# Altium project PCB.PrjPcb
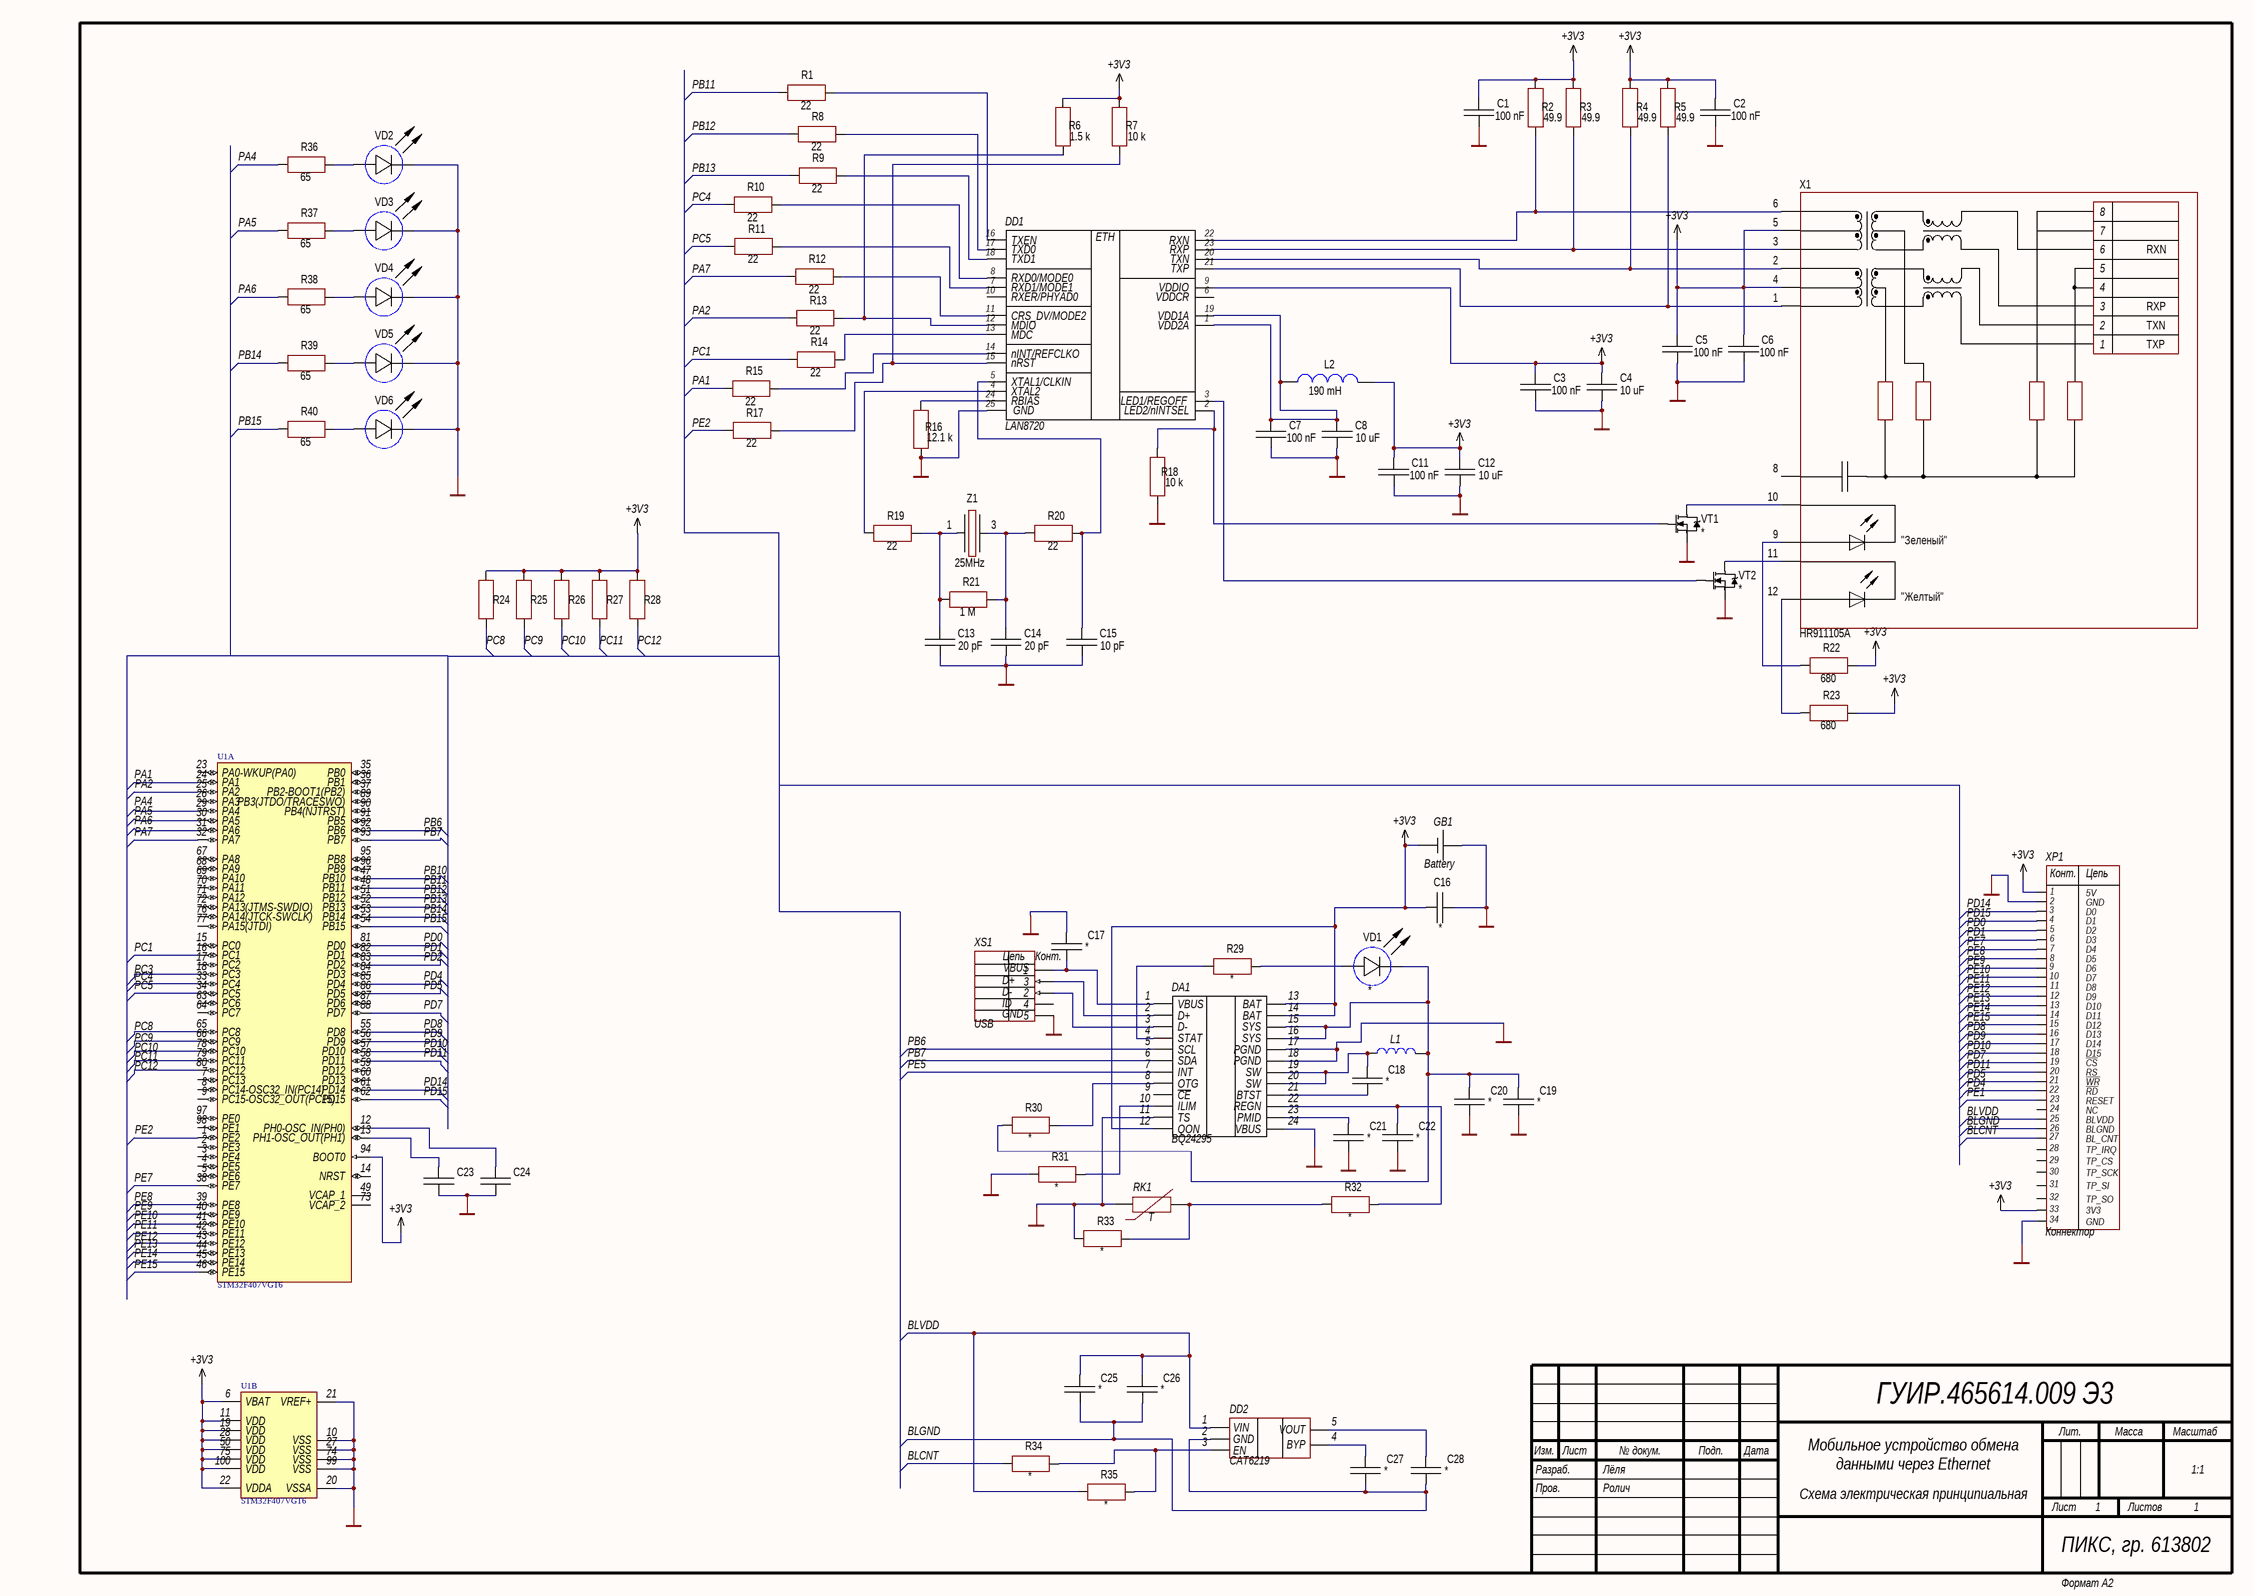
[diagram p0: Shcematic.SchDoc]
1 sheet, 86 parts. Net scope: global (net labels, ports and power ports of the same name join across sheets).
Board files: Ïå÷àòíàÿÏëàòàÑÝêðàíîì.PcbDoc, Ïå÷àòíàÿÏëàòà.PcbDoc

## Sheet Shcematic.SchDoc: Мобильное устройство обмена
size 594 x 420 mm; CheckedBy: Ролич; Author: Лёля; CompanyName: ПИКС, гр. 613802; Address1: Address1; Address2: Address2; Address3: Address3; Address4: Address4; DocumentNumber: ГУИР.465614.009 Э3; SheetNumber: 1; SheetTotal: 1; Scale: 1:1; Title2str: данными через Ethernet; DocumentType: Схема электрическая принципиальная; FirstReferrence: АБВГ.123456.001

### Parts
C1  100 nF  [CH0805C]
C2  100 nF  [CH0805C]
C3  100 nF  [CH0805C]
C4  10 uF  [CH0805C]
C5  100 nF  [CH0805C]
C6  100 nF  [CH0805C]
C7  100 nF  [CH0805C]
C8  10 uF  [CH0805C]
C11  100 nF  [CH0805C]
C12  10 uF  [CH0805C]
C13  20 pF  [CH0805C]
C14  20 pF  [CH0805C]
C15  10 pF  [CH0805C]
C16  *  [CH0805C]
C17  *  [CH0805C]
C18  *  [CH0805C]
C19  *  [CH0805C]
C20  *  [CH0805C]
C21  *  [CH0805C]
C22  *  [CH0805C]
C23  (no value)  [CH0805C]
C24  (no value)  [CH0805C]
C25  *  [CH0805C]
C26  *  [CH0805C]
C27  *  [CH0805C]
C28  *  [CH0805C]
DA1  BQ24295  [BQ24295]
DD1  LAN8720  [*QFN50P400X400X100-25N - duplicate]
DD2  CAT6219  [CAT6219]
GB1  Battery  [Battery]
L1  Inductor  [CH0805L]  (value not drawn)
L2  190 mH  [CH0805L]
R1  22  [CH0805R]
R2  49.9  [CH0805R]
R3  49.9  [CH0805R]
R4  49.9  [CH0805R]
R5  49.9  [CH0805R]
R6  1.5 k  [CH0805R]
R7  10 k  [CH0805R]
R8  22  [CH0805R]
R9  22  [CH0805R]
R10  22  [CH0805R]
R11  22  [CH0805R]
R12  22  [CH0805R]
R13  22  [CH0805R]
R14  22  [CH0805R]
R15  22  [CH0805R]
R16  12.1 k  [CH0805R]
R17  22  [CH0805R]
R18  10 k  [CH0805R]
R19  22  [CH0805R]
R20  22  [CH0805R]
R21  1 M  [CH0805R]
R22  680  [CH0805R]
R23  680  [CH0805R]
R24  (no value)  [CH0805R]
R25  (no value)  [CH0805R]
R26  (no value)  [CH0805R]
R27  (no value)  [CH0805R]
R28  (no value)  [CH0805R]
R29  *  [CH0805R]
R30  *  [CH0805R]
R31  *  [CH0805R]
R32  *  [CH0805R]
R33  *  [CH0805R]
R34  *  [CH0805R]
R35  *  [CH0805R]
R36  65  [CH0805R]
R37  65  [CH0805R]
R38  65  [CH0805R]
R39  65  [CH0805R]
R40  65  [CH0805R]
RK1  Resistor_termo  [0805 (Resistor)]  (value not drawn)
U1  STM32F407VGT6  [STM-LQFP100_L]  (parts A,B of 2)
VD1  *  [CH0603LB]
VD2  *  [CH0603LB]  (value not drawn)
VD3  *  [CH0603LB]  (value not drawn)
VD4  *  [CH0603LB]  (value not drawn)
VD5  *  [CH0603LB]  (value not drawn)
VD6  *  [CH0603LB]  (value not drawn)
VT1  *  [SOT23_123]
VT2  *  [SOT23_123]
X1  HR911105A  [CON: HR911105A]
XP1  Коннектор  [Connector]
XS1  USB  [USB]
Z1  25MHz  [OSC: 3215]

### Nets
+3V3: C1.1 C2.1 C3.1 C4.1 C5.1 C6.1 C11.1 C12.1 C16.1 DA1.12(QON) DA1.13(BAT) DA1.14(BAT) DD1.9(VDDIO) GB1.1 L2.1 R2.2 R3.2 R4.2 R5.2 R6.2 R7.2 R22.2 R23.2 R24.2 R25.2 R26.2 R27.2 R28.2 U1.6(VBAT) U1.11(VDD) U1.19(VDD) U1.22(VDDA) U1.28(VDD) U1.50(VDD) U1.75(VDD) U1.94(BOOT0) U1.100(VDD) X1.4(CT) X1.5(CT) XP1.1(5V) XP1.33(3V3)
GND: C1.2 C2.2 C3.2 C4.2 C5.2 C6.2 C7.2 C8.2 C11.2 C12.2 C13.2 C14.2 C15.2 C16.2 C17.1 C19.2 C20.2 C21.2 C22.2 C23.2 C24.2 DA1.11(TS) DA1.17(PGND) DA1.18(PGND) DA1.24(VBUS) DD1.25(GND) GB1.2 R16.1 R18.1 R31.1 R33.1 RK1.1 U1.10(VSS) U1.20(VSSA) U1.21(VREF+) U1.27(VSS) U1.74(VSS) U1.99(VSS) VD2.2(C) VD3.2(C) VD4.2(C) VD5.2(C) VD6.2(C) VT1.3(S) VT2.3(S) XP1.2(GND) XP1.34(GND) XS1.5
BLCNT: R34.1 XP1.27(BL_CNT)
BLGND: C25.2 C26.2 C27.2 C28.2 DD2.2(GND) XP1.26(BLGND)
BLVDD: C25.1 C26.1 DD2.1(VIN) R35.1 XP1.25(BLVDD)
PA1: R15.1 U1.24(PA1)
PA2: R13.1 U1.25(PA2)
PA4: R36.1 U1.29(PA4)
PA5: R37.1 U1.30(PA5)
PA6: R38.1 U1.31(PA6)
PA7: R12.1 U1.32(PA7)
PB6: DA1.5(SCL) U1.92(PB6)
PB7: DA1.6(SDA) U1.93(PB7)
PB10: U1.47(PB10)
PB11: R1.1 U1.48(PB11)
PB12: R8.1 U1.51(PB12)
PB13: R9.1 U1.52(PB13)
PB14: R39.1 U1.53(PB14)
PB15: R40.1 U1.54(PB15)
PC1: R14.1 U1.16(PC1)
PC3: U1.18(PC3)
PC4: R10.1 U1.33(PC4)
PC5: R11.1 U1.34(PC5)
PC8: R24.1 U1.65(PC8)
PC9: R25.1 U1.66(PC9)
PC10: R26.1 U1.78(PC10)
PC11: R27.1 U1.79(PC11)
PC12: R28.1 U1.80(PC12)
PD0: U1.81(PD0) XP1.5(D2)
PD1: U1.82(PD1) XP1.6(D3)
PD2: U1.83(PD2)
PD4: U1.85(PD4) XP1.22(~{RD})
PD5: U1.86(PD5) XP1.21(~{WR})
PD7: U1.88(PD7) XP1.19(~{CS})
PD8: U1.55(PD8) XP1.16(D13)
PD9: U1.56(PD9) XP1.17(D14)
PD10: U1.57(PD10) XP1.18(D15)
PD11: U1.58(PD11) XP1.20(RS)
PD14: U1.61(PD14) XP1.3(D0)
PD15: U1.62(PD15) XP1.4(D1)
PE1: XP1.23(RESET)
PE2: R17.1 U1.1(PE2)
PE5: DA1.7(INT)
PE7: U1.38(PE7) XP1.7(D4)
PE8: U1.39(PE8) XP1.8(D5)
PE9: U1.40(PE9) XP1.9(D6)
PE10: U1.41(PE10) XP1.10(D7)
PE11: U1.42(PE11) XP1.11(D8)
PE12: U1.43(PE12) XP1.12(D9)
PE13: U1.44(PE13) XP1.13(D10)
PE14: U1.45(PE14) XP1.14(D11)
PE15: U1.46(PE15) XP1.15(D12)
NetC7_1: C7.1 C8.1 DD1.1(VDD2A) DD1.19(VDD1A) L2.2
NetC13_1: C13.1 R19.2 R21.1 Z1.1
NetC14_1: C14.1 R20.1 R21.2 Z1.3
NetC15_1: C15.1 DD1.5(XTAL1/CLKIN) R20.2
NetC17_2: C17.2 DA1.1(VBUS) XS1.1
NetC18_1: C18.1 DA1.19(SW) DA1.20(SW) L1.1
NetC18_2: C18.2 DA1.21(BTST)
NetC19_1: C19.1 C20.1 DA1.15(SYS) DA1.16(SYS) L1.2 R30.1 VD1.2(C)
NetC21_1: C21.1 DA1.23(PMID)
NetC22_1: C22.1 DA1.22(REGN) R32.2
NetC23_1: C23.1 U1.13(PH1-OSC_OUT(PH1))
NetC24_1: C24.1 U1.12(PH0-OSC_IN(PH0))
NetC27_1: C27.1 DD2.4(BYP)
NetC28_1: C28.1 DD2.5(VOUT)
NetDA1_2: DA1.2(D+) XS1.3
NetDA1_3: DA1.3(D-) XS1.2
NetDA1_4: DA1.4(STAT) R29.1
NetDA1_8: DA1.8(OTG) R30.2
NetDA1_10: DA1.10(ILIM) R31.2
NetDD1_2: DD1.2(LED2/nINTSEL) R18.2 VT1.1(G)
NetDD1_3: DD1.3(LED1/REGOFF) VT2.1(G)
NetDD1_4: DD1.4(XTAL2) R19.1
NetDD1_7: DD1.7(RXD1/MODE1) R11.2
NetDD1_8: DD1.8(RXD0/MODE0) R10.2
NetDD1_11: DD1.11(CRS_DV/MODE2) R12.2
NetDD1_12: DD1.12(MDIO) R6.1 R13.2
NetDD1_13: DD1.13(MDC) R14.2
NetDD1_14: DD1.14(nINT/REFCLKO) R15.2
NetDD1_15: DD1.15(nRST) R7.1 R17.2
NetDD1_16: DD1.16(TXEN) R1.2
NetDD1_17: DD1.17(TXD0) R8.2
NetDD1_18: DD1.18(TXD1) R9.2
NetDD1_20: DD1.20(TXN) R4.1 X1.2(TD-)
NetDD1_21: DD1.21(TXP) R5.1 X1.1(TD+)
NetDD1_22: DD1.22(RXN) R2.1 X1.6(RD-)
NetDD1_23: DD1.23(RXP) R3.1 X1.3(RD+)
NetDD1_24: DD1.24(RBIAS) R16.2
NetDD2_3: DD2.3(EN) R34.2 R35.2
NetR22_1: R22.1 X1.9(D2)
NetR23_1: R23.1 X1.12(D4)
NetR29_2: R29.2 VD1.1(A)
NetR32_1: R32.1 R33.2 RK1.2
NetR36_2: R36.2 VD2.1(A)
NetR37_2: R37.2 VD3.1(A)
NetR38_2: R38.2 VD4.1(A)
NetR39_2: R39.2 VD5.1(A)
NetR40_2: R40.2 VD6.1(A)
NetVT1_2: VT1.2(D) X1.10(D1)
NetVT2_2: VT2.2(D) X1.11(D3)

Not connected (* = marked no-connect by the designer): DA1 9(~{CE}); DD1 6(VDDCR) 10(RXER/PHYAD0); U1 2(PE3) 3(PE4) 4(PE5) 5(PE6) 7(PC13) 8(PC14-OSC32_IN(PC14)) 9(PC15-OSC32_OUT(PC15)) 14(NRST) 15(PC0) 17(PC2) 23(PA0-WKUP(PA0)) 26(PA3) 35(PB0) 36(PB1) 37(PB2-BOOT1(PB2)) 49(VCAP_1) 59(PD12) 60(PD13) 63(PC6) 64(PC7) 67(PA8) 68(PA9) 69(PA10) 70(PA11) 71(PA12) 72(PA13(JTMS-SWDIO)) 73(VCAP_2) 76(PA14(JTCK-SWCLK)) 77(PA15(JTDI)) 84(PD3) 87(PD6) 89(PB3(JTDO/TRACESWO)) 90(PB4(NJTRST)) 91(PB5) 95(PB8) 96(PB9) 97(PE0) 98(PE1); X1 8(GND); XP1 24(NC) 28(TP_IRQ) 29(TP_CS) 30(TP_SCK) 31(TP_SI) 32(TP_SO); XS1 4

### Notes on the sheet
- Разраб.
- Изм.
- Лист
- № докум.
- Подп.
- Дата
- Лит.
- Масса
- Масштаб
- Пров.
- Листов
- Формат А2
- (in symbol Connector) Конт.; Цепь
- (in symbol HR911105A) 7; RXN; RXP; TXN; TXP; "Зеленый"; "Желтый"
- (in symbol LAN8720) ETH
- (in symbol Resistor_termo) T
- (in symbol USB) Цепь; Конт.; VBUS; D+; D-; ID; GND

### Library data of the parts
C1-C8 C11-C28 = Capacitor: Manufacturer: *; Model: *; HelpURL: *; ComponentKind: *
  C1-C3 C5-C7 C11: Value: 100 nF
  C4 C8 C12: Value: 10 uF
  C13 C14: Value: 20 pF
  C15: Value: 10 pF
  C16-C22 C25-C28: Value: *
DA1 = BQ24295: PWR
L1 = Inductor: Code_IEC: 1005; Value: 10mH; Published: 8-Jun-2000; LatestRevisionDate: 29-May-2009; LatestRevisionNote: IPC-7351 Footprint Added.; PackageReference: 0402-A; Publisher: Altium Limited; PackageDescription: Chip Inductor; Code_JEITA: 0402
L2 = Inductor: Manufacturer: *; Model: *; HelpURL: *; ComponentKind: *; Value: 190 mH
R1-R40 = Resistor: Manufacturer: *; Model: *; HelpURL: *; ComponentKind: *
  R1 R8-R15 R17 R19 R20: Value: 22
  R2-R5: Value: 49.9
  R6: Value: 1.5 k
  R7 R18: Value: 10 k
  R16: Value: 12.1 k
  R21: Value: 1 M
  R22 R23: Value: 680
  R29-R35: Value: *
  R36-R40: Value: 65
U1 = STM32F407VGT6: ARM Cortex-M4 32-bit MCU+FPU, 210 DMIPS, 1024 kB Flash, 192 kB Internal RAM, 82 I/Os, 100-pin LQFP, -40 to 85 degC, Tray; Manufacturer: STMicroelectronics; D/A Converter: 2x12-bit; FLASH Size (Prog) (kB): 1024; I/Os (High Current): 82; Internal RAM Size (kB): 192; Operating Frequency(F) (Processor speed) (MHz): 168; Supply Voltage(Vcc) max (V): 3.6; Supply Voltage(Vcc) min (V): 1.8; DatasheetVersion: Rev. 4; PackageVersion: Rev. 1, 06/2013; PackageReference: LQFP100; PackageDescription: 100-Pin Low Profile Quad Flat Package, 14 x 14 mm Body, 0.5 mm Pitch; Supplier 1: Digi-Key; Supplier Part Number 1: 497-11605-ND; Supplier 2: Farnell; Supplier Part Number 2: 2064368; Supplier 3: Newark; Supplier Part Number 3: 73T2333; Supplier 4: Mouser; Supplier Part Number 4: 511-STM32F407VGT6; Core: ARM Cortex-M4; Packing: Tray; Mounting Technology: Surface Mount; PartNumber: STM32F407VGT6; ComponentLink1Description: Manufacturer URL; ComponentLink1URL: http://www.st.com/web/en/home.html; ComponentLink2Description: Datasheet; ComponentLink2URL: http://www.st.com/st-web-ui/static/active/en/resource/technical/document/datasheet/DM00037051.pdf; ComponentLink3Description: Package Specification; ComponentLink3URL: http://www.st.com/st-web-ui/static/active/en/resource/technical/document/data_brief/DM00071938.pdf
VD1-VD6 = LED: Manufacturer: *; Model: *; HelpURL: *; ComponentKind: *; Value: *
VT1 VT2 = N-chanel: Mosfet; Model: *; Manufacturer: *; ComponentKind: *; HelpURL: *
X1 = HR911105A: Ethernet RJ-45; Manufacturer: Hanrun Electronics Co., Ltd.; Model: HR911105A; HelpURL: *; ComponentKind: *
XP1 = Connector
Z1 = Oscillator: Manufacturer: *; Model: *; HelpURL: *; ComponentKind: *; Value: 25MHz